# EAGLE board vr99-south-revA (EAGLE 9.6.2), part 1 of 3
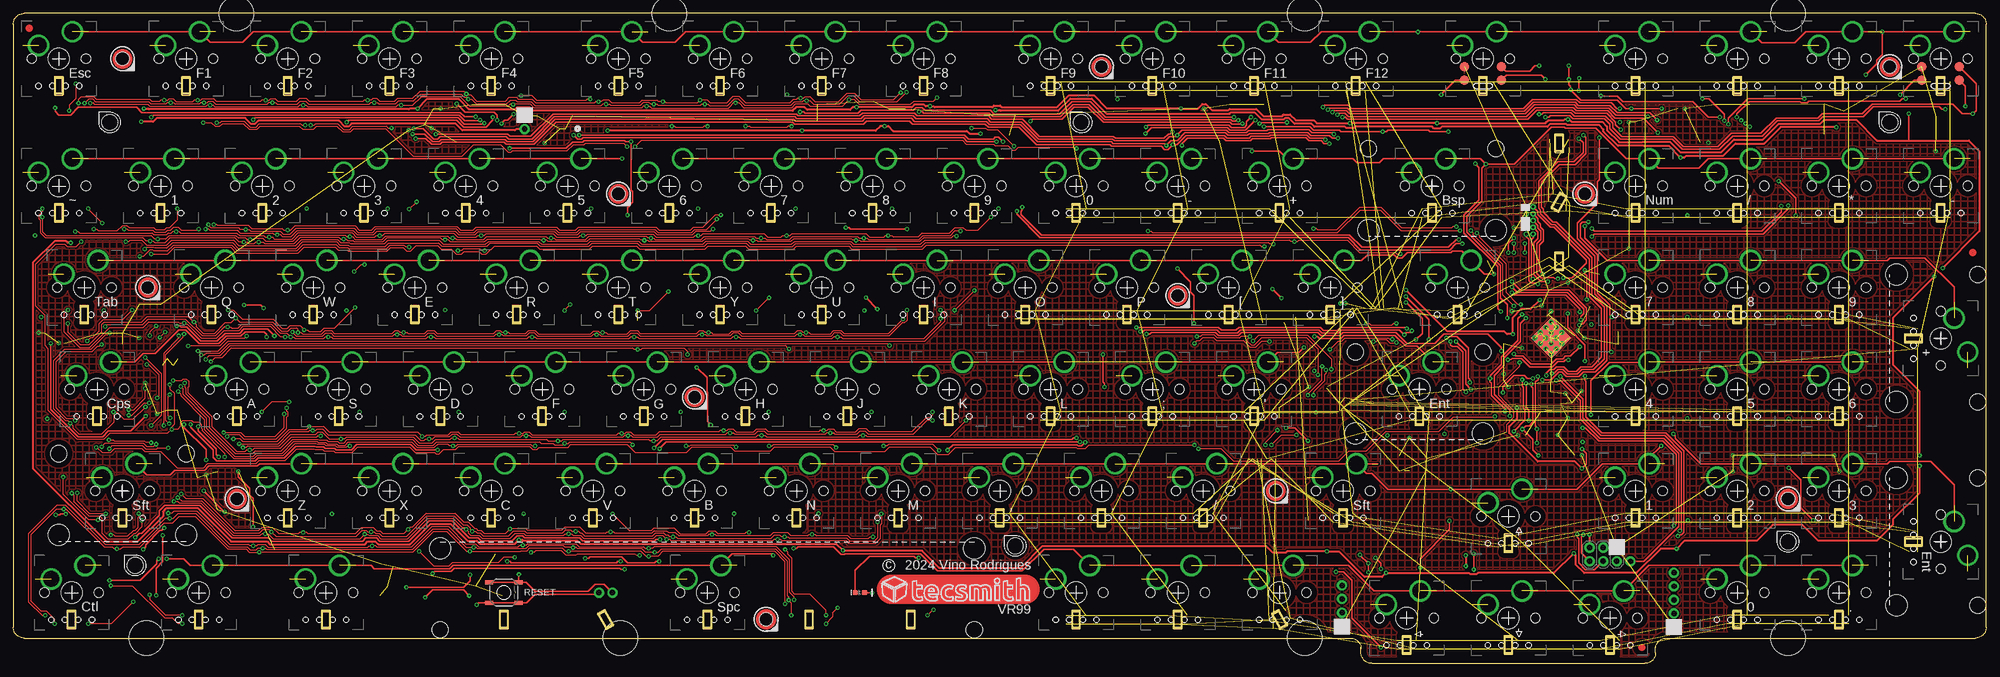
[diagram p4: board, top side]
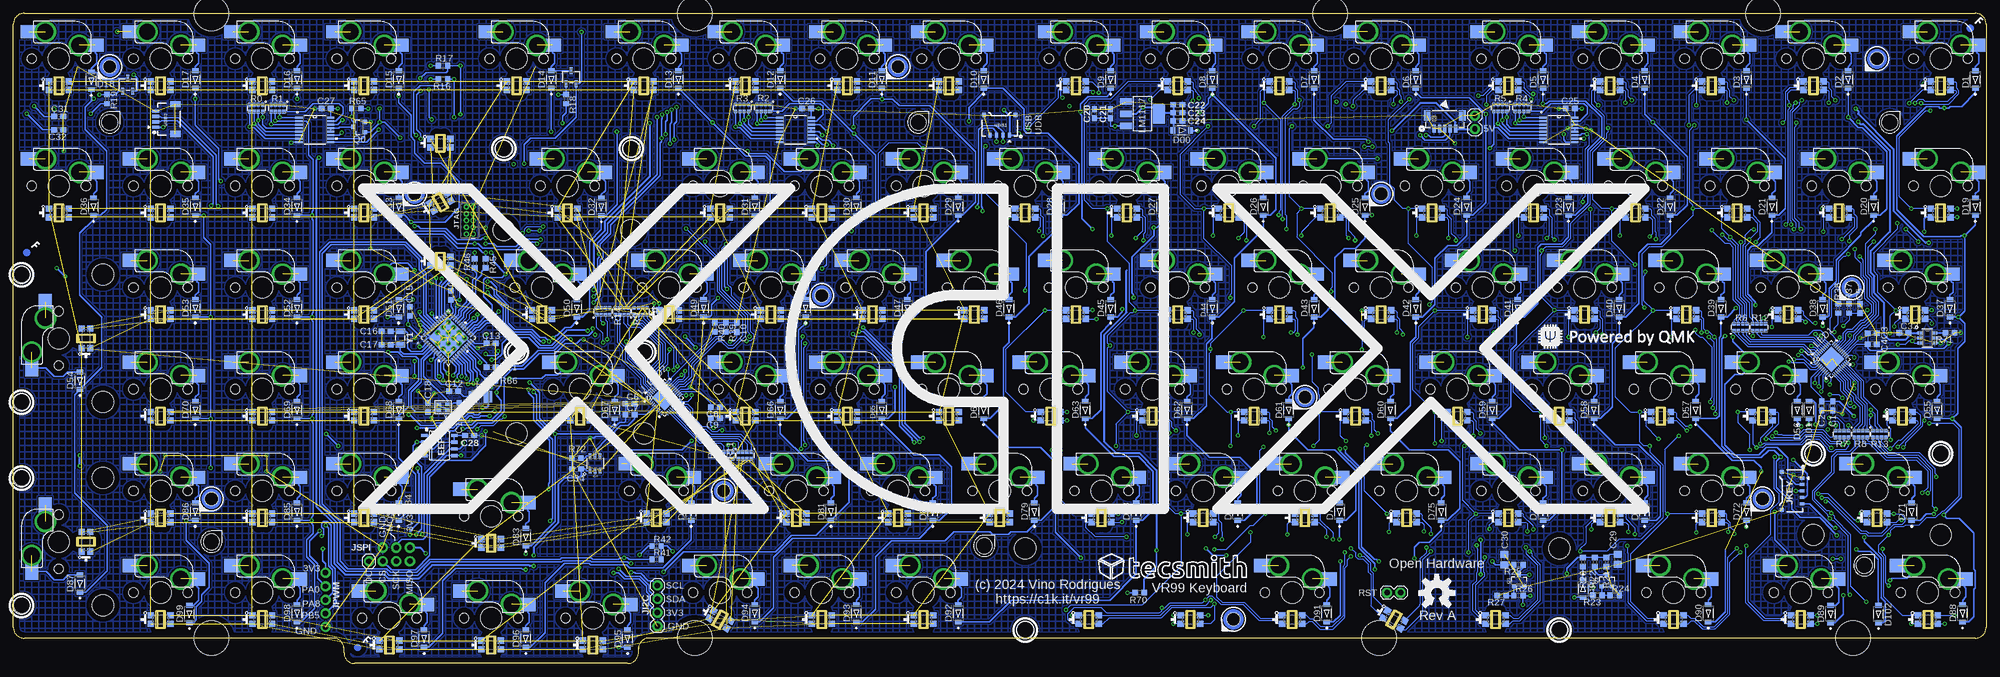
[diagram p5: board, bottom side, seen from below]

Size 369.48 x 121.83 mm. Coordinates in mm from the lower left corner, seen from the top.
Outline: 252.41,2.76 252.41,2 arc90 254.41,0 305.56,0 arc90 307.56,2 307.56,2.76
Outline: 252.41,2.76 252.41,3
Outline: 307.56,2.76 307.56,3
Outline: 307.56,2.76 arc-90 309.56,4.76 367.48,4.76 arc90 369.48,6.76 369.48,119.83 arc90 367.48,121.83 2,121.83 arc90 0,119.83 0,6.76 arc90 2,4.76 250.41,4.76 arc-90 252.41,2.76
Copper layers (1*16): Top 0.035mm / dielectric 1.5mm / Bottom 0.035mm
Design rules "default *": minimum track width 6mil, minimum drill 0.35mm, track to track 9.5mil, track to pad 9.5mil, pad to pad 9.5mil, via to via 9.5mil, smd to smd 9.5mil, copper to edge 40mil, drill to drill 4mil, minimum pad ring 10mil, minimum via ring 8mil, stop-mask expansion 4mil, vias tented up to drill 0mil, thermal gap 9.5mil
Holes 6.5 mm at 332.38,121.8 241.89,121.8 122.83,121.8 41.83,121.8 332.38,4.79 241.89,4.79 113.72,4.79 24.97,4.79

## Footprints (pad centres in the part's own frame; a part is rotated, then mirrored left to right if it is on the bottom)
1X02 = drill 1.016 pad 1.88: 1 0,0; 2 2.54,0
C0603 = smd 1.1 x 1: 1 -0.85,0; 2 0.85,0
0603 = smd 1.1 x 1: 1 -0.85,0; 2 0.85,0
C0805 = smd 1.3 x 1.5: 1 -0.95,0; 2 0.95,0
SOD-123 = smd 0.914 x 1.219: A 1.638,0; C -1.638,0
LED-0603 = smd 1 x 1: A -0.877,0; C 0.877,0
8-SOIC = smd 0.6 x 1.2: 1 -1.905,-2.8; 2 -0.635,-2.8; 3 0.635,-2.8; 4 1.905,-2.8; 5 1.905,2.8; 6 0.635,2.8; 7 -0.635,2.8; 8 -1.905,2.8
MGEEK-M2-HOLE = hole 3: 0,0
BRUTAL-1800-HOLE = hole 2.5: 0,0
MX-STABS-200U = hole 3.988: -11.938,8.255; 11.938,8.255 | hole 3.048: -11.938,-6.985; 11.938,-6.985
MX-STABS-625U = hole 3.988: -50,8.255; 50,8.255 | hole 3.048: -50,-6.985; 50,-6.985
1X04 = drill 1.016 pad 1.88: 1 0,0; 2 2.54,0; 3 5.08,0; 4 7.62,0
MOLEX_781710005 = smd 0.6 x 0.85: 1 -2.4,2; 2 -1.2,2; 3 0,2; 4 1.2,2; 5 2.4,2 | smd 0.7 x 0.8: NC1 -3.55,-1.775; NC2 3.55,-1.775
1X05_NO_SILK = drill 1.016 pad 1.88: 1 0,0; 2 2.54,0; 3 5.08,0; 4 7.62,0; 5 10.16,0
2X3-NS = drill 1.016 pad 1.88: 1 -2.54,-1.27; 2 -2.54,1.27; 3 0,-1.27; 4 0,1.27; 5 2.54,-1.27; 6 2.54,1.27
1X01 = drill 1.016 pad 1.88: 1 0,0
2X5-PTH-1.27MM-NO_SILK = drill 0.508 pad 1: 1 -2.54,-0.635; 2 -2.54,0.635; 3 -1.27,-0.635; 4 -1.27,0.635; 5 0,-0.635; 6 0,0.635; 7 1.27,-0.635; 8 1.27,0.635; 9 2.54,-0.635; 10 2.54,0.635
L3225M = smd 1.6 x 2.2: 1 -1.4,0; 2 1.4,0
SOT223 = smd 1.219 x 2.235: 1 -2.311,-3.099; 2 0,-3.099; 3 2.311,-3.099 | smd 3.6 x 2.2: 4 0,3.099
CONN5_SM05B-SRSS_JST = smd 0.66 x 1.549: 1 -2,-1.772; 2 -1,-1.772; 3 0,-1.772; 4 1,-1.772; 5 2,-1.772 | smd 1.295 x 1.905: 6 -3.3,0.698; 7 3.3,0.698
SOT23-3 = smd 0.8 x 0.9: 1 -0.95,-1; 2 0.95,-1; 3 0,1.1
R0603X4 = smd 0.7 x 0.6: 1 -0.65,1.2; 2 -0.65,0.4; 3 -0.65,-0.4; 4 -0.65,-1.2; 5 0.65,-1.2; 6 0.65,-0.4; 7 0.65,0.4; 8 0.65,1.2
R0603 = smd 1 x 1.1: 1 -0.85,0; 2 0.85,0
TACTILE_SWITCH_SMD_5.2MM = smd 1.524 x 0.762: 1 -2.794,1.905; 2 2.794,1.905; 3 -2.794,-1.905; 4 2.794,-1.905
MX-5-PIN-HOTSWAP-PAD = smd 3.15 x 2.5 bottom: 1@1 -6.785,2.54; 2@1 5.542,5.08 | drill 3 pad 3.75: 1@2 -3.81,2.54; 2@2 2.54,5.08 | hole 3.988: 0,0 | hole 1.75: -5.08,0; 5.08,0
MX-5-PIN-SKYLOONG-KNOB = smd 3.15 x 2.5 bottom: 1@1 -6.785,2.54; 2@1 5.542,5.08 | drill 3 pad 3.75: 1@2 -3.81,2.54; 2@2 2.54,5.08 | smd 1.75 x 1.75: A 3.5,-4; B 3.5,-1.5; C -3.5,-1.5; S -3.5,-4 | hole 3.988: 0,0 | hole 1.75: -5.08,0; 5.08,0
SOT-23-3L_AOS = smd 0.559 x 1.321: 1 -0.953,-1.194; 2 0.953,-1.194; 3 0,1.194
UFQFPN-48_7X7X0P55MM-THERM = smd 0.813 x 0.305: 1 -3.454,2.75; 2 -3.454,2.25; 3 -3.454,1.75; 4 -3.454,1.25; 5 -3.454,0.75; 6 -3.454,0.25; 7 -3.454,-0.25; 8 -3.454,-0.75; 9 -3.454,-1.25; 10 -3.454,-1.75; 11 -3.454,-2.25; 12 -3.454,-2.75; 25 3.454,-2.75; 26 3.454,-2.25; 27 3.454,-1.75; 28 3.454,-1.25; 29 3.454,-0.75; 30 3.454,-0.25; 31 3.454,0.25; 32 3.454,0.75; 33 3.454,1.25; 34 3.454,1.75; 35 3.454,2.25; 36 3.454,2.75 | smd 0.305 x 0.813: 13 -2.75,-3.454; 14 -2.25,-3.454; 15 -1.75,-3.454; 16 -1.25,-3.454; 17 -0.75,-3.454; 18 -0.25,-3.454; 19 0.25,-3.454; 20 0.75,-3.454; 21 1.25,-3.454; 22 1.75,-3.454; 23 2.25,-3.454; 24 2.75,-3.454; 37 2.75,3.454; 38 2.25,3.454; 39 1.75,3.454; 40 1.25,3.454; 41 0.75,3.454; 42 0.25,3.454; 43 -0.25,3.454; 44 -0.75,3.454; 45 -1.25,3.454; 46 -1.75,3.454; 47 -2.25,3.454; 48 -2.75,3.454 | smd 5 x 5.4: 49 0.2,0 | smd 0.4 x 5: 49@1 -2.5,-0.2 | smd 0.56 x 0.29 rotated 45: 49@2 -2.4,2.4 | smd 5.4 x 5.4 bottom: 49@3 0,0 | drill 0.4: 49@4 -0.711,2.134; 49@5 0.711,2.134; 49@6 2.134,2.134; 49@7 -2.134,0.711; 49@8 -0.711,0.711; 49@9 0.711,0.711; 49@10 2.134,0.711; 49@11 -2.134,-0.711; 49@12 -0.711,-0.711; 49@13 0.711,-0.711; 49@14 2.134,-0.711; 49@15 -2.134,-2.134; 49@16 -0.711,-2.134; 49@17 0.711,-2.134; 49@18 2.134,-2.134
TSSOP16 = smd 1.408 x 0.356: 1 -2.952,2.275; 2 -2.952,1.625; 3 -2.952,0.975; 4 -2.952,0.325; 5 -2.952,-0.325; 6 -2.952,-0.975; 7 -2.952,-1.625; 8 -2.952,-2.275; 9 2.952,-2.275; 10 2.952,-1.625; 11 2.952,-0.975; 12 2.952,-0.325; 13 2.952,0.325; 14 2.952,0.975; 15 2.952,1.625; 16 2.952,2.275
SOT-23-THIN-6_DDC_TEX = smd 1.003 x 0.559: 1 -1.378,0.95; 2 -1.378,0; 3 -1.378,-0.95; 4 1.378,-0.95; 5 1.378,0; 6 1.378,0.95
UQFN40 = smd 0.813 x 0.203: 1 -2.4,1.8; 2 -2.4,1.4; 3 -2.4,1; 4 -2.4,0.6; 5 -2.4,0.2; 6 -2.4,-0.2; 7 -2.4,-0.6; 8 -2.4,-1; 9 -2.4,-1.4; 10 -2.4,-1.8; 21 2.4,-1.8; 22 2.4,-1.4; 23 2.4,-1; 24 2.4,-0.6; 25 2.4,-0.2; 26 2.4,0.2; 27 2.4,0.6; 28 2.4,1; 29 2.4,1.4; 30 2.4,1.8 | smd 0.203 x 0.813: 11 -1.8,-2.4; 12 -1.4,-2.4; 13 -1,-2.4; 14 -0.6,-2.4; 15 -0.2,-2.4; 16 0.2,-2.4; 17 0.6,-2.4; 18 1,-2.4; 19 1.4,-2.4; 20 1.8,-2.4; 31 1.8,2.4; 32 1.4,2.4; 33 1,2.4; 34 0.6,2.4; 35 0.2,2.4; 36 -0.2,2.4; 37 -0.6,2.4; 38 -1,2.4; 39 -1.4,2.4; 40 -1.8,2.4 | smd 3 x 3.4: EPAD 0.225,0 | smd 0.566 x 0.566 rotated 315: EPAD@1 -1.278,1.299 | smd 0.4 x 3: EPAD@2 -1.477,-0.2
MOLEX_781710004 = smd 0.6 x 0.85: 1 -1.8,2; 2 -0.6,2; 3 0.6,2; 4 1.8,2 | smd 0.7 x 0.8: NC1 -2.95,-1.775; NC2 2.95,-1.775
JST_SM04B-SRSS-TB_LF_SN = smd 0.6 x 1.35: 1 -1.5,0; 2 -0.5,0; 3 0.5,0; 4 1.5,0 | smd 1.2 x 2: NC1 2.8,-3.675; NC2 -2.8,-3.675
CRYSTAL-SMD-3.2X1.5MM = smd 1 x 1.8: P$1 -1.25,0; P$2 1.25,0
CRYSTAL_2.5X2 = smd 0.9 x 0.75: 1 -0.825,-0.625; 2 0.825,-0.625; 3 0.825,0.625; 4 -0.825,0.625
156120M173000-MILL = smd 1.2 x 1.2: 1 -1.85,0.8; 2 -1.85,-0.8; 3 1.85,-0.8; 4 1.85,0.8

## Placement (x,y rotation side)
5V  [1X02]  95.75,100.15 90 bottom
C1  1uF  [C0603]  28.73,48.25 90 bottom
C2  0.1uF  [C0603]  30.77,48.25 90 bottom
C3  1uF  [C0603]  21.3,61.9 180 bottom
C4  0.1uF  [C0603]  21.3,59.83 180 bottom
C5  0.1uF  [C0603]  23.65,66.53 270 bottom
C6  1uF  [C0603]  254,48.67 0 bottom
C7  0.1uF  [C0603]  254,46.62 0 bottom
C8  1uF  [C0603]  238,48 180 bottom
C9  0.1uF  [C0603]  238,45.98 180 bottom
C10  0.1uF  [C0603]  234,63 270 bottom
C11  22uF  [C0603]  280,55.5 0 bottom
C12  100nF  [C0603]  287,51 180 bottom
C13  100nF  [C0603]  280,60 0 bottom
C14  100nF  [C0603]  287.5,69 90 bottom
C15  100nF  [C0603]  295.23,66 90 bottom
C16  4.3pF  [C0603]  299.65,62.25 180 bottom
C17  4.3pF  [C0603]  299.65,59.75 180 bottom
C18  12pF  [C0603]  291.85,48 90 bottom
C19  12pF  [C0603]  286,48 270 bottom
C20  22uF  [0603]  167,103 90 bottom
C21  100nF  [0603]  164,103 90 bottom
C22  100nF  [0603]  151.4,104.7 0 bottom
C23  22uF  [0603]  151.4,103.2 0 bottom
C24  4.7uF  [0603]  151.4,101.7 0 bottom
C25  100nF  [0603]  77.9,104 180 bottom
C26  100nF  [0603]  220.9,104 180 bottom
C27  100nF  [0603]  310.9,104 180 bottom
C28  100nF  [0603]  284,42.75 0 bottom
C29  10uF  [C0805]  68.95,19.5 270 bottom
C30  100nF  [C0805]  90.2,19.48 270 bottom
C31  100nF  [C0603]  361,102.5 0 bottom
C32  100nF  [C0603]  361,100 0 bottom
C33  1uF  [C0603]  15.42,61.95 0 bottom
C34  1uF  [C0603]  264.02,36.45 0 bottom
D00  B5819W SL  [SOD-123]  150.65,99.9 180 bottom
D1  [SOD-123]  2.03,109.43 90 bottom
D2  [SOD-123]  25.84,109.43 90 bottom
D3  [SOD-123]  44.89,109.43 90 bottom
D4  [SOD-123]  63.94,109.43 90 bottom
D5  [SOD-123]  82.99,109.43 90 bottom
D6  [SOD-123]  106.81,109.43 90 bottom
D7  [SOD-123]  125.86,109.43 90 bottom
D8  [SOD-123]  144.91,109.43 90 bottom
D9  [SOD-123]  163.96,109.43 90 bottom
D10  [SOD-123]  187.77,109.43 90 bottom
D11  [SOD-123]  206.82,109.43 90 bottom
D12  [SOD-123]  225.87,109.43 90 bottom
D13  [SOD-123]  244.92,109.43 90 bottom
D14  [SOD-123]  268.73,109.43 90 bottom
D15  [SOD-123]  297.31,109.43 90 bottom
D16  [SOD-123]  316.36,109.43 90 bottom
D17  [SOD-123]  335.41,109.43 90 bottom
D18  [SOD-123]  354.88,109.2 90 bottom
D19  [SOD-123]  2.03,85.61 90 bottom
D20  [SOD-123]  21.08,85.61 90 bottom
D21  [SOD-123]  40.13,85.61 90 bottom
D22  [SOD-123]  59.18,85.61 90 bottom
D23  [SOD-123]  78.23,85.61 90 bottom
D24  [SOD-123]  97.28,85.61 90 bottom
D25  [SOD-123]  116.33,85.61 90 bottom
D26  [SOD-123]  135.38,85.61 90 bottom
D27  [SOD-123]  154.43,85.61 90 bottom
D28  [SOD-123]  173.48,85.61 90 bottom
D29  [SOD-123]  192.53,85.61 90 bottom
D30  [SOD-123]  211.58,85.61 90 bottom
D31  [SOD-123]  230.63,85.61 90 bottom
D32  [SOD-123]  259.36,85.54 90 bottom
D33  [SOD-123]  297.31,85.61 90 bottom
D34  [SOD-123]  316.36,85.61 90 bottom
D35  [SOD-123]  335.41,85.61 90 bottom
D36  [SOD-123]  354.46,85.61 90 bottom
D37  [SOD-123]  6.79,66.56 90 bottom
D38  [SOD-123]  30.61,66.56 90 bottom
D39  [SOD-123]  49.66,66.56 90 bottom
D40  [SOD-123]  68.71,66.56 90 bottom
D41  [SOD-123]  87.76,66.56 90 bottom
D42  [SOD-123]  106.81,66.56 90 bottom
D43  [SOD-123]  125.86,66.56 90 bottom
D44  [SOD-123]  144.91,66.56 90 bottom
D45  [SOD-123]  163.96,66.56 90 bottom
D46  [SOD-123]  183.01,66.56 90 bottom
D47  [SOD-123]  202.06,66.56 90 bottom
D48  [SOD-123]  221.11,66.56 90 bottom
D49  [SOD-123]  240.21,66.56 90 bottom
D50  [SOD-123]  263.97,66.56 90 bottom
D51  [SOD-123]  297.31,66.56 90 bottom
D52  [SOD-123]  316.36,66.56 90 bottom
D53  [SOD-123]  335.41,66.56 90 bottom
D54  [SOD-123]  357,53 90 bottom
D55  [SOD-123]  9.18,47.52 90 bottom
D56  [SOD-123]  35.37,47.52 90 bottom
D57  [SOD-123]  54.42,47.52 90 bottom
D58  [SOD-123]  73.47,47.52 90 bottom
D59  [SOD-123]  92.52,47.52 90 bottom
D60  [SOD-123]  111.57,47.52 90 bottom
D61  [SOD-123]  130.62,47.52 90 bottom
D62  [SOD-123]  149.67,47.52 90 bottom
D63  [SOD-123]  168.72,47.52 90 bottom
D64  [SOD-123]  187.77,47.52 90 bottom
D65  [SOD-123]  206.82,47.52 90 bottom
D66  [SOD-123]  225.87,47.52 90 bottom
D67  [SOD-123]  256.82,47.52 90 bottom
D68  [SOD-123]  297.31,47.52 90 bottom
D69  [SOD-123]  316.36,47.52 90 bottom
D70  [SOD-123]  335.41,47.52 90 bottom
D71  [SOD-123]  13.94,28.46 90 bottom
D72  [SOD-123]  44.89,28.46 90 bottom
D73  [SOD-123]  63.94,28.46 90 bottom
D74  [SOD-123]  82.99,28.46 90 bottom
D75  [SOD-123]  102.04,28.46 90 bottom
D76  [SOD-123]  121.09,28.46 90 bottom
D77  [SOD-123]  140.14,28.46 90 bottom
D78  [SOD-123]  159.19,28.46 90 bottom
D79  [SOD-123]  178.24,28.46 90 bottom
D80  [SOD-123]  197.29,28.46 90 bottom
D81  [SOD-123]  216.34,28.46 90 bottom
D82  [SOD-123]  242.54,28.46 90 bottom
D83  [SOD-123]  273.49,23.7 90 bottom
D84  [SOD-123]  297.31,28.46 90 bottom
D85  [SOD-123]  316.36,28.46 90 bottom
D86  [SOD-123]  335.41,28.46 90 bottom
D87  [SOD-123]  357,15 90 bottom
D88  [SOD-123]  4.41,9.41 90 bottom
D89  [SOD-123]  29.12,9.29 90 bottom
D90  [SOD-123]  52.04,9.41 90 bottom
D91  [SOD-123]  123.47,9.41 90 bottom
D92  [SOD-123]  192.53,9.41 90 bottom
D93  [SOD-123]  211.58,9.41 90 bottom
D94  [SOD-123]  230.63,9.41 90 bottom
D95  [SOD-123]  254.44,4.65 90 bottom
D96  [SOD-123]  273.49,4.65 90 bottom
D97  [SOD-123]  292.54,4.65 90 bottom
D98  [SOD-123]  316.36,9.41 90 bottom
D99  [SOD-123]  336.51,9.29 90 bottom
D100  1N4148  [SOD-123]  75.5,14 270 bottom
D101  DNP  [SOD-123]  33.17,47.52 90 bottom
D102  DNP  [SOD-123]  20.18,9.29 90 bottom
D107  BLUE  [LED-0603]  158.54,13.29 180 top
EEP  M25C  [8-SOIC]  289.69,40.85 270 bottom
G1  MGEEK-M2-HOLE  [MGEEK-M2-HOLE]  18.05,101.39 0 top
G2  MGEEK-M2-HOLE  [MGEEK-M2-HOLE]  200,101.39 0 top
G3  MGEEK-M2-HOLE  [MGEEK-M2-HOLE]  351.43,101.39 0 top
G4  MGEEK-M2-HOLE  [MGEEK-M2-HOLE]  332.38,22.81 0 top
G5  MGEEK-M2-HOLE  [MGEEK-M2-HOLE]  187.65,22.05 0 top
G6  MGEEK-M2-HOLE  [MGEEK-M2-HOLE]  22.81,18.39 0 top
H1  BRURAL-1800-HOLE  [BRUTAL-1800-HOLE]  351.43,111.8 0 top
H2  BRURAL-1800-HOLE  [BRUTAL-1800-HOLE]  203.79,111.8 0 top
H3  BRURAL-1800-HOLE  [BRUTAL-1800-HOLE]  20.43,113.3 0 top
H4  BRURAL-1800-HOLE  [BRUTAL-1800-HOLE]  294.3,87.99 0 top
H5  BRURAL-1800-HOLE  [BRUTAL-1800-HOLE]  113.3,87.99 0 top
H6  BRURAL-1800-HOLE  [BRUTAL-1800-HOLE]  218.07,68.94 0 top
H7  BRURAL-1800-HOLE  [BRUTAL-1800-HOLE]  25.19,70.44 0 top
H8  BRURAL-1800-HOLE  [BRUTAL-1800-HOLE]  127.59,49.89 0 top
H9  BRURAL-1800-HOLE  [BRUTAL-1800-HOLE]  332.38,30.84 0 top
H10  BRURAL-1800-HOLE  [BRUTAL-1800-HOLE]  236.43,32.34 0 top
H11  BRURAL-1800-HOLE  [BRUTAL-1800-HOLE]  140.97,8.29 0 top
H12  BRURAL-1800-HOLE  [BRUTAL-1800-HOLE]  41.89,30.84 0 top
H_BSP  MX-STABS-200U  [MX-STABS-200U]  265.7,89.49 180 top
H_ENT  MX-STABS-200U  [MX-STABS-200U]  263.32,51.39 180 top
H_LS  MX-STABS-200U  [MX-STABS-200U]  20.43,32.34 180 top
H_NEN  MX-STABS-200U  [MX-STABS-200U]  360.95,22.81 90 top
H_NP  MX-STABS-200U  [MX-STABS-200U]  360.95,60.91 90 top
H_SPC  MX-STABS-625U  [MX-STABS-625U]  129.97,13.29 0 top
JI2C  [1X04]  248.84,14.62 270 bottom
JKEY  MOLEX_0781710005  [MOLEX_781710005]  36.5,32.34 270 bottom
JPWM  [1X05_NO_SILK]  311,17 270 top
JSPI  DNP  [2X3-NS]  297.75,20.45 0 top
JSPI@2  [1X01]  302.85,19.15 270 bottom
JTAG  CORTEX_JTAG_DEBUG_PTH_NS  [2X5-PTH-1.27MM-NO_SILK]  284,83 90 bottom
L1  10uH ±10%  [L3225M]  282,50 0 bottom
LM1117  AMS1117-3.3  [SOT223]  158,103 270 bottom
LOGO1  OSHW-LOGOL  [OSHW-LOGO-L]  102.89,13.22 0 bottom
M_M2  SM05B-SRSS-TB(LF)(SN)  [CONN5_SM05B-SRSS_JST]  101.39,102 0 bottom
Q0  2N7002  [SOT23-3]  304.68,100.53 90 bottom
Q1  2N7002  [SOT23-3]  87.5,15.5 0 bottom
Q2  2N7002  [SOT23-3]  71.05,15.5 0 bottom
R0  10K  [R0603X4]  324,104.05 270 bottom
R1  10K  [R0603X4]  320,104.05 270 bottom
R2  10K  [R0603X4]  229,104.1 270 bottom
R3  10K  [R0603X4]  233,104.1 270 bottom
R4  10K  [R0603X4]  87,104.1 270 bottom
R5  10K  [R0603X4]  91,104.1 270 bottom
R6  20R  [R0603X4]  46,63 90 bottom
R7  20R  [R0603X4]  27,43 270 bottom
R8  20R  [R0603X4]  23.5,43 270 bottom
R9  20R  [R0603X4]  255.5,66 90 bottom
R10  20R  [R0603X4]  252,66 90 bottom
R11  20R  [R0603X4]  232.5,39 270 bottom
R12  51R  [R0603X4]  42.5,63 90 bottom
R13  51R  [R0603X4]  20,43 270 bottom
R14  51R  [R0603X4]  259,66 90 bottom
R15  51R  [R0603X4]  236,39 270 bottom
R16  5.1K  [R0603]  289,109.5 180 bottom
R17  5.1K  [R0603]  289,112 180 bottom
R18  10K  [R0603]  265.95,105.75 270 bottom
R19  10K  [R0603]  351.95,105.75 270 bottom
R20  330K  [R0603]  75.5,19 270 bottom
R21  1M  [R0603]  71.1,19 90 bottom
R22  10K  [R0603]  73.3,19 90 bottom
R23  10K  [R0603]  72.75,12.75 180 bottom
R24  100K  [R0603]  69.55,12.75 0 bottom
R25  100R  [R0603]  87.6,18.5 180 bottom
R26  1K  [R0603]  87.6,12.72 0 bottom
R27  10K  [R0603]  90.72,12.72 180 bottom
R37  100K  [R0603]  25.68,66.53 270 bottom
R38  10K  [R0603]  27.73,66.53 270 bottom
R39  100K  [R0603]  236.05,63 270 bottom
R40  10K  [R0603]  238.1,63 270 bottom
R41  4K7  [R0603]  249,19.5 0 bottom
R42  4K7  [R0603]  249,22 0 bottom
R45  10R  [R0603]  281,75 270 bottom
R46  10R  [R0603]  283.05,75 270 bottom
R65  5.1K  [R0603]  305.25,104 0 bottom
R66  10K  [R0603]  280,53 180 bottom
R70  1K  [R0603]  158.54,13.29 180 bottom
R71  1K  [R0603]  6.75,61.97 180 bottom
R72  1K  [R0603]  264.02,38.48 0 bottom
RST  [1X02]  112.21,13.29 0 bottom
S1  Reset  [TACTILE_SWITCH_SMD_5.2MM]  91.87,13.29 0 top
SW_0  MX-5-PIN-HOTSWAP-PAD  [MX-5-PIN-HOTSWAP-PAD]  199.03,89.49 0 top
SW_1  MX-5-PIN-HOTSWAP-PAD  [MX-5-PIN-HOTSWAP-PAD]  27.57,89.49 0 top
SW_2  MX-5-PIN-HOTSWAP-PAD  [MX-5-PIN-HOTSWAP-PAD]  46.62,89.49 0 top
SW_3  MX-5-PIN-HOTSWAP-PAD  [MX-5-PIN-HOTSWAP-PAD]  65.67,89.49 0 top
SW_4  MX-5-PIN-HOTSWAP-PAD  [MX-5-PIN-HOTSWAP-PAD]  84.72,89.49 0 top
SW_5  MX-5-PIN-HOTSWAP-PAD  [MX-5-PIN-HOTSWAP-PAD]  103.78,89.49 0 top
SW_6  MX-5-PIN-HOTSWAP-PAD  [MX-5-PIN-HOTSWAP-PAD]  122.83,89.49 0 top
SW_7  MX-5-PIN-HOTSWAP-PAD  [MX-5-PIN-HOTSWAP-PAD]  141.88,89.49 0 top
SW_8  MX-5-PIN-HOTSWAP-PAD  [MX-5-PIN-HOTSWAP-PAD]  160.93,89.49 0 top
SW_9  MX-5-PIN-HOTSWAP-PAD  [MX-5-PIN-HOTSWAP-PAD]  179.97,89.49 0 top
SW_A  MX-5-PIN-HOTSWAP-PAD  [MX-5-PIN-HOTSWAP-PAD]  41.86,51.39 0 top
SW_B  MX-5-PIN-HOTSWAP-PAD  [MX-5-PIN-HOTSWAP-PAD]  127.59,32.34 0 top
SW_BSP  MX-5-PIN-HOTSWAP-PAD  [MX-5-PIN-HOTSWAP-PAD]  265.7,89.49 0 top
SW_C  MX-5-PIN-HOTSWAP-PAD  [MX-5-PIN-HOTSWAP-PAD]  89.49,32.34 0 top
SW_CB  MX-5-PIN-HOTSWAP-PAD  [MX-5-PIN-HOTSWAP-PAD]  246.65,70.44 0 top
SW_CL  MX-5-PIN-HOTSWAP-PAD  [MX-5-PIN-HOTSWAP-PAD]  15.67,51.39 0 top
SW_CM  MX-5-PIN-HOTSWAP-PAD  [MX-5-PIN-HOTSWAP-PAD]  184.74,32.34 0 top
SW_CS  MX-5-PIN-HOTSWAP-PAD  [MX-5-PIN-HOTSWAP-PAD]  213.31,51.39 0 top
SW_D  MX-5-PIN-HOTSWAP-PAD  [MX-5-PIN-HOTSWAP-PAD]  79.96,51.39 0 top
SW_DN  MX-5-PIN-HOTSWAP-PAD  [MX-5-PIN-HOTSWAP-PAD]  279.99,8.53 0 top
SW_DP  MX-5-PIN-HOTSWAP-PAD  [MX-5-PIN-HOTSWAP-PAD]  270.46,70.44 0 top
SW_DSH  MX-5-PIN-HOTSWAP-PAD  [MX-5-PIN-HOTSWAP-PAD]  322.85,89.49 0 top
SW_DT  MX-5-PIN-HOTSWAP-PAD  [MX-5-PIN-HOTSWAP-PAD]  203.79,32.34 0 top
SW_E  MX-5-PIN-HOTSWAP-PAD  [MX-5-PIN-HOTSWAP-PAD]  75.2,70.44 0 top
SW_ENT  MX-5-PIN-HOTSWAP-PAD  [MX-5-PIN-HOTSWAP-PAD]  263.32,51.39 0 top
SW_EP  MX-5-PIN-HOTSWAP-PAD  [MX-5-PIN-HOTSWAP-PAD]  237.12,89.49 0 top
SW_ESC  MX-5-PIN-HOTSWAP-PAD  [MX-5-PIN-HOTSWAP-PAD]  8.53,113.3 0 top
SW_F  MX-5-PIN-HOTSWAP-PAD  [MX-5-PIN-HOTSWAP-PAD]  99.01,51.39 0 top
SW_F1  MX-5-PIN-HOTSWAP-PAD  [MX-5-PIN-HOTSWAP-PAD]  32.34,113.3 0 top
SW_F2  MX-5-PIN-HOTSWAP-PAD  [MX-5-PIN-HOTSWAP-PAD]  51.39,113.3 0 top
SW_F3  MX-5-PIN-HOTSWAP-PAD  [MX-5-PIN-HOTSWAP-PAD]  70.44,113.3 0 top
SW_F4  MX-5-PIN-HOTSWAP-PAD  [MX-5-PIN-HOTSWAP-PAD]  89.49,113.3 0 top
SW_F5  MX-5-PIN-HOTSWAP-PAD  [MX-5-PIN-HOTSWAP-PAD]  113.3,113.3 0 top
SW_F6  MX-5-PIN-HOTSWAP-PAD  [MX-5-PIN-HOTSWAP-PAD]  132.35,113.3 0 top
SW_F7  MX-5-PIN-HOTSWAP-PAD  [MX-5-PIN-HOTSWAP-PAD]  151.4,113.3 0 top
SW_F8  MX-5-PIN-HOTSWAP-PAD  [MX-5-PIN-HOTSWAP-PAD]  170.45,113.3 0 top
SW_F9  MX-5-PIN-HOTSWAP-PAD  [MX-5-PIN-HOTSWAP-PAD]  194.26,113.3 0 top
SW_F10  MX-5-PIN-HOTSWAP-PAD  [MX-5-PIN-HOTSWAP-PAD]  213.31,113.3 0 top
SW_F11  MX-5-PIN-HOTSWAP-PAD  [MX-5-PIN-HOTSWAP-PAD]  232.36,113.3 0 top
SW_F12  MX-5-PIN-HOTSWAP-PAD  [MX-5-PIN-HOTSWAP-PAD]  251.41,113.3 0 top
SW_F13  MX-5-PIN-SKYLOONG-KNOB  [MX-5-PIN-SKYLOONG-KNOB]  275.23,113.3 0 top
SW_F14  MX-5-PIN-HOTSWAP-PAD  [MX-5-PIN-HOTSWAP-PAD]  303.8,113.3 0 top
SW_F15  MX-5-PIN-HOTSWAP-PAD  [MX-5-PIN-HOTSWAP-PAD]  322.85,113.3 0 top
SW_F16  MX-5-PIN-HOTSWAP-PAD  [MX-5-PIN-HOTSWAP-PAD]  341.9,113.3 0 top
SW_F17  MX-5-PIN-SKYLOONG-KNOB  [MX-5-PIN-SKYLOONG-KNOB]  360.95,113.3 0 top
SW_FS  MX-5-PIN-HOTSWAP-PAD  [MX-5-PIN-HOTSWAP-PAD]  222.84,32.34 0 top
SW_G  MX-5-PIN-HOTSWAP-PAD  [MX-5-PIN-HOTSWAP-PAD]  118.06,51.39 0 top
SW_H  MX-5-PIN-HOTSWAP-PAD  [MX-5-PIN-HOTSWAP-PAD]  137.11,51.39 0 top
SW_I  MX-5-PIN-HOTSWAP-PAD  [MX-5-PIN-HOTSWAP-PAD]  170.45,70.44 0 top
SW_J  MX-5-PIN-HOTSWAP-PAD  [MX-5-PIN-HOTSWAP-PAD]  156.16,51.39 0 top
SW_K  MX-5-PIN-HOTSWAP-PAD  [MX-5-PIN-HOTSWAP-PAD]  175.21,51.39 0 top
SW_L  MX-5-PIN-HOTSWAP-PAD  [MX-5-PIN-HOTSWAP-PAD]  194.26,51.39 0 top
SW_LA  MX-5-PIN-HOTSWAP-PAD  [MX-5-PIN-HOTSWAP-PAD]  58.53,13.29 0 top
SW_LC  MX-5-PIN-HOTSWAP-PAD  [MX-5-PIN-HOTSWAP-PAD]  10.91,13.29 0 top
SW_LF  MX-5-PIN-HOTSWAP-PAD  [MX-5-PIN-HOTSWAP-PAD]  260.94,8.53 0 top
SW_LS  MX-5-PIN-HOTSWAP-PAD  [MX-5-PIN-HOTSWAP-PAD]  20.43,32.34 0 top
SW_LW  MX-5-PIN-HOTSWAP-PAD  [MX-5-PIN-HOTSWAP-PAD]  34.72,13.29 0 top
SW_M  MX-5-PIN-HOTSWAP-PAD  [MX-5-PIN-HOTSWAP-PAD]  165.69,32.34 0 top
SW_MIN  MX-5-PIN-HOTSWAP-PAD  [MX-5-PIN-HOTSWAP-PAD]  360.95,89.49 0 top
SW_MU  MX-5-PIN-HOTSWAP-PAD  [MX-5-PIN-HOTSWAP-PAD]  218.07,89.49 0 top
SW_MUL  MX-5-PIN-HOTSWAP-PAD  [MX-5-PIN-HOTSWAP-PAD]  341.9,89.49 0 top
SW_N  MX-5-PIN-HOTSWAP-PAD  [MX-5-PIN-HOTSWAP-PAD]  146.64,32.34 0 top
SW_N0  MX-5-PIN-HOTSWAP-PAD  [MX-5-PIN-HOTSWAP-PAD]  322.85,13.29 0 top
SW_N1  MX-5-PIN-HOTSWAP-PAD  [MX-5-PIN-HOTSWAP-PAD]  303.8,32.34 0 top
SW_N2  MX-5-PIN-HOTSWAP-PAD  [MX-5-PIN-HOTSWAP-PAD]  322.85,32.34 0 top
SW_N3  MX-5-PIN-HOTSWAP-PAD  [MX-5-PIN-HOTSWAP-PAD]  341.9,32.34 0 top
SW_N4  MX-5-PIN-HOTSWAP-PAD  [MX-5-PIN-HOTSWAP-PAD]  303.8,51.39 0 top
SW_N5  MX-5-PIN-HOTSWAP-PAD  [MX-5-PIN-HOTSWAP-PAD]  322.85,51.39 0 top
SW_N6  MX-5-PIN-HOTSWAP-PAD  [MX-5-PIN-HOTSWAP-PAD]  341.9,51.39 0 top
SW_N7  MX-5-PIN-HOTSWAP-PAD  [MX-5-PIN-HOTSWAP-PAD]  303.8,70.44 0 top
SW_N8  MX-5-PIN-HOTSWAP-PAD  [MX-5-PIN-HOTSWAP-PAD]  322.85,70.44 0 top
SW_N9  MX-5-PIN-HOTSWAP-PAD  [MX-5-PIN-HOTSWAP-PAD]  341.9,70.44 0 top
SW_ND  MX-5-PIN-HOTSWAP-PAD  [MX-5-PIN-HOTSWAP-PAD]  341.9,13.29 0 top
SW_NEN  MX-5-PIN-HOTSWAP-PAD  [MX-5-PIN-HOTSWAP-PAD]  360.95,22.81 270 top
SW_NP  MX-5-PIN-HOTSWAP-PAD  [MX-5-PIN-HOTSWAP-PAD]  360.95,60.91 270 top
SW_NUM  MX-5-PIN-HOTSWAP-PAD  [MX-5-PIN-HOTSWAP-PAD]  303.8,89.49 0 top
SW_O  MX-5-PIN-HOTSWAP-PAD  [MX-5-PIN-HOTSWAP-PAD]  189.5,70.44 0 top
SW_OB  MX-5-PIN-HOTSWAP-PAD  [MX-5-PIN-HOTSWAP-PAD]  227.6,70.44 0 top
SW_P  MX-5-PIN-HOTSWAP-PAD  [MX-5-PIN-HOTSWAP-PAD]  208.55,70.44 0 top
SW_Q  MX-5-PIN-HOTSWAP-PAD  [MX-5-PIN-HOTSWAP-PAD]  37.1,70.44 0 top
SW_QU  MX-5-PIN-HOTSWAP-PAD  [MX-5-PIN-HOTSWAP-PAD]  232.36,51.39 0 top
SW_R  MX-5-PIN-HOTSWAP-PAD  [MX-5-PIN-HOTSWAP-PAD]  94.25,70.44 0 top
SW_RA  MX-5-PIN-HOTSWAP-PAD  [MX-5-PIN-HOTSWAP-PAD]  199.03,13.29 0 top
SW_RC  MX-5-PIN-HOTSWAP-PAD  [MX-5-PIN-HOTSWAP-PAD]  237.12,13.29 0 top
SW_RS  MX-5-PIN-HOTSWAP-PAD  [MX-5-PIN-HOTSWAP-PAD]  249.03,32.34 0 top
SW_RT  MX-5-PIN-HOTSWAP-PAD  [MX-5-PIN-HOTSWAP-PAD]  299.04,8.53 0 top
SW_RW  MX-5-PIN-HOTSWAP-PAD  [MX-5-PIN-HOTSWAP-PAD]  218.07,13.29 0 top
SW_S  MX-5-PIN-HOTSWAP-PAD  [MX-5-PIN-HOTSWAP-PAD]  60.91,51.39 0 top
SW_SPC  MX-5-PIN-HOTSWAP-PAD  [MX-5-PIN-HOTSWAP-PAD]  129.97,13.29 0 top
SW_T  MX-5-PIN-HOTSWAP-PAD  [MX-5-PIN-HOTSWAP-PAD]  113.3,70.44 0 top
SW_TAB  MX-5-PIN-HOTSWAP-PAD  [MX-5-PIN-HOTSWAP-PAD]  13.29,70.44 0 top
SW_TDL  MX-5-PIN-HOTSWAP-PAD  [MX-5-PIN-HOTSWAP-PAD]  8.53,89.49 0 top
SW_U  MX-5-PIN-HOTSWAP-PAD  [MX-5-PIN-HOTSWAP-PAD]  151.4,70.44 0 top
SW_UP  MX-5-PIN-HOTSWAP-PAD  [MX-5-PIN-HOTSWAP-PAD]  279.99,27.57 0 top
SW_V  MX-5-PIN-HOTSWAP-PAD  [MX-5-PIN-HOTSWAP-PAD]  108.54,32.34 0 top
SW_W  MX-5-PIN-HOTSWAP-PAD  [MX-5-PIN-HOTSWAP-PAD]  56.15,70.44 0 top
SW_X  MX-5-PIN-HOTSWAP-PAD  [MX-5-PIN-HOTSWAP-PAD]  70.44,32.34 0 top
SW_Y  MX-5-PIN-HOTSWAP-PAD  [MX-5-PIN-HOTSWAP-PAD]  132.35,70.44 0 top
SW_Z  MX-5-PIN-HOTSWAP-PAD  [MX-5-PIN-HOTSWAP-PAD]  51.39,32.34 0 top
T2  AO3401A  [SOT-23-3L_AOS]  265,109.85 0 bottom
T3  AO3401A  [SOT-23-3L_AOS]  348.05,108.47 0 bottom
U1  STM32F411CEU7THERM  [UFQFPN-48_7X7X0P55MM-THERM]  288,61 45 bottom
U2  74HC589A_DT  [TSSOP16]  80,100 0 bottom
U3  74HC589A_DT  [TSSOP16]  223,100 0 bottom
U4  74HC589A_DT  [TSSOP16]  313,100 0 bottom
U5  TPS22995H-Q1  [SOT-23-THIN-6_DDC_TEX]  11,61 0 bottom
U6  TPS22995H-Q1  [SOT-23-THIN-6_DDC_TEX]  260.5,37.5 90 bottom
U$1  FIDUCIAL  [FIDUCIAL]  3,119 0 top
U$2  FIDUCIAL  [FIDUCIAL]  305,3 0 top
U$3  FIDUCIAL  [FIDUCIAL]  367,77 0 top
U$4  QMK_LOGO  [QMK_LOGO]  83.98,58.91 0 bottom
U$5  TECSMITH-LOGOLONG  [TECSMITH-NAME]  163.85,18.3 0 bottom
U$6  TECSMITH-LOGOLONG  [TECSMITH-NAME]  165,14 0 top
U_LED1  IS31FL3743B  [UQFN40]  29,57 45 bottom
U_LED2  IS31FL3743B  [UQFN40]  247.5,49.79 45 bottom
UDB1  [MOLEX_781710004]  184.74,101 180 bottom
UDB2  [JST_SM04B-SRSS-TB_LF_SN]  342.8,102 90 bottom
Y1  32.768kHz ±20ppm 6pF  [CRYSTAL-SMD-3.2X1.5MM]  297,61 90 bottom
Y2  25MHz 9pF  [CRYSTAL_2.5X2]  289,48 180 bottom
Z1  156120M173000MILL  [156120M173000-MILL]  8.53,108.25 0 bottom
Z2  156120M173000MILL  [156120M173000-MILL]  32.34,108.25 0 bottom
Z3  156120M173000MILL  [156120M173000-MILL]  51.39,108.25 0 bottom
Z4  156120M173000MILL  [156120M173000-MILL]  70.44,108.25 0 bottom
Z5  156120M173000MILL  [156120M173000-MILL]  89.49,108.25 0 bottom
Z6  156120M173000MILL  [156120M173000-MILL]  113.3,108.25 0 bottom
Z7  156120M173000MILL  [156120M173000-MILL]  132.35,108.25 0 bottom
Z8  156120M173000MILL  [156120M173000-MILL]  151.4,108.25 0 bottom
Z9  156120M173000MILL  [156120M173000-MILL]  170.45,108.25 0 bottom
Z10  156120M173000MILL  [156120M173000-MILL]  194.26,108.25 0 bottom
Z11  156120M173000MILL  [156120M173000-MILL]  213.31,108.25 0 bottom
Z12  156120M173000MILL  [156120M173000-MILL]  232.36,108.25 0 bottom
Z13  156120M173000MILL  [156120M173000-MILL]  251.41,108.25 0 bottom
Z14  156120M173000MILL  [156120M173000-MILL]  275.23,108.25 0 bottom
Z15  156120M173000MILL  [156120M173000-MILL]  303.8,108.25 0 bottom
Z16  156120M173000MILL  [156120M173000-MILL]  322.85,108.25 0 bottom
Z17  156120M173000MILL  [156120M173000-MILL]  341.9,108.25 0 bottom
Z18  156120M173000MILL  [156120M173000-MILL]  360.95,108.25 0 bottom
Z19  DNP  [156120M173000-MILL]  8.53,84.44 0 bottom
Z20  156120M173000MILL  [156120M173000-MILL]  27.57,84.44 0 bottom
Z21  156120M173000MILL  [156120M173000-MILL]  46.62,84.44 0 bottom
Z22  156120M173000MILL  [156120M173000-MILL]  65.67,84.44 0 bottom
Z23  156120M173000MILL  [156120M173000-MILL]  84.72,84.44 0 bottom
Z24  156120M173000MILL  [156120M173000-MILL]  103.78,84.44 0 bottom
Z25  156120M173000MILL  [156120M173000-MILL]  122.83,84.44 0 bottom
Z26  156120M173000MILL  [156120M173000-MILL]  141.88,84.44 0 bottom
Z27  156120M173000MILL  [156120M173000-MILL]  160.93,84.44 0 bottom
Z28  156120M173000MILL  [156120M173000-MILL]  179.97,84.44 0 bottom
Z29  156120M173000MILL  [156120M173000-MILL]  199.03,84.44 0 bottom
Z30  156120M173000MILL  [156120M173000-MILL]  218.07,84.44 0 bottom
Z31  156120M173000MILL  [156120M173000-MILL]  237.12,84.44 0 bottom
Z32  156120M173000MILL  [156120M173000-MILL]  265.7,84.44 0 bottom
Z33  156120M173000MILL  [156120M173000-MILL]  303.8,84.44 0 bottom
Z34  156120M173000MILL  [156120M173000-MILL]  322.85,84.44 0 bottom
Z35  156120M173000MILL  [156120M173000-MILL]  341.9,84.44 0 bottom
Z36  156120M173000MILL  [156120M173000-MILL]  360.95,84.44 0 bottom
Z37  156120M173000MILL  [156120M173000-MILL]  13.29,65.39 0 bottom
Z38  156120M173000MILL  [156120M173000-MILL]  37.1,65.39 0 bottom
Z39  156120M173000MILL  [156120M173000-MILL]  56.15,65.39 0 bottom
Z40  156120M173000MILL  [156120M173000-MILL]  75.2,65.39 0 bottom
Z41  156120M173000MILL  [156120M173000-MILL]  94.25,65.39 0 bottom
Z42  156120M173000MILL  [156120M173000-MILL]  113.3,65.39 0 bottom
Z43  156120M173000MILL  [156120M173000-MILL]  132.35,65.39 0 bottom
Z44  156120M173000MILL  [156120M173000-MILL]  151.4,65.39 0 bottom
Z45  156120M173000MILL  [156120M173000-MILL]  170.45,65.39 0 bottom
Z46  156120M173000MILL  [156120M173000-MILL]  189.5,65.39 0 bottom
Z47  156120M173000MILL  [156120M173000-MILL]  208.55,65.39 0 bottom
Z48  156120M173000MILL  [156120M173000-MILL]  227.6,65.39 0 bottom
Z49  156120M173000MILL  [156120M173000-MILL]  246.65,65.39 0 bottom
Z50  156120M173000MILL  [156120M173000-MILL]  270.46,65.39 0 bottom
Z51  156120M173000MILL  [156120M173000-MILL]  303.8,65.39 0 bottom
Z52  156120M173000MILL  [156120M173000-MILL]  322.85,65.39 0 bottom
Z53  156120M173000MILL  [156120M173000-MILL]  341.9,65.39 0 bottom
Z54  156120M173000MILL  [156120M173000-MILL]  355.87,60.91 90 bottom
Z55  156120M173000MILL  [156120M173000-MILL]  15.67,46.34 0 bottom
Z56  156120M173000MILL  [156120M173000-MILL]  41.86,46.34 0 bottom
Z57  156120M173000MILL  [156120M173000-MILL]  60.91,46.34 0 bottom
Z58  156120M173000MILL  [156120M173000-MILL]  79.96,46.34 0 bottom
Z59  156120M173000MILL  [156120M173000-MILL]  99.01,46.34 0 bottom
Z60  156120M173000MILL  [156120M173000-MILL]  118.06,46.34 0 bottom
Z61  156120M173000MILL  [156120M173000-MILL]  137.11,46.34 0 bottom
Z62  156120M173000MILL  [156120M173000-MILL]  156.16,46.34 0 bottom
Z63  156120M173000MILL  [156120M173000-MILL]  175.21,46.34 0 bottom
Z64  156120M173000MILL  [156120M173000-MILL]  194.26,46.34 0 bottom
Z65  156120M173000MILL  [156120M173000-MILL]  213.31,46.34 0 bottom
Z66  156120M173000MILL  [156120M173000-MILL]  232.36,46.34 0 bottom
Z67  156120M173000MILL  [156120M173000-MILL]  263.32,46.34 0 bottom
Z68  156120M173000MILL  [156120M173000-MILL]  303.8,46.34 0 bottom
Z69  156120M173000MILL  [156120M173000-MILL]  322.85,46.34 0 bottom
Z70  156120M173000MILL  [156120M173000-MILL]  341.9,46.34 0 bottom
Z71  156120M173000MILL  [156120M173000-MILL]  20.43,27.29 0 bottom
Z72  156120M173000MILL  [156120M173000-MILL]  51.39,27.29 0 bottom
Z73  156120M173000MILL  [156120M173000-MILL]  70.44,27.29 0 bottom
Z74  156120M173000MILL  [156120M173000-MILL]  89.49,27.29 0 bottom
Z75  156120M173000MILL  [156120M173000-MILL]  108.54,27.29 0 bottom
Z76  156120M173000MILL  [156120M173000-MILL]  127.59,27.29 0 bottom
Z77  156120M173000MILL  [156120M173000-MILL]  146.64,27.29 0 bottom
Z78  156120M173000MILL  [156120M173000-MILL]  165.69,27.29 0 bottom
Z79  156120M173000MILL  [156120M173000-MILL]  184.74,27.29 0 bottom
Z80  156120M173000MILL  [156120M173000-MILL]  203.79,27.29 0 bottom
Z81  156120M173000MILL  [156120M173000-MILL]  222.84,27.29 0 bottom
Z82  156120M173000MILL  [156120M173000-MILL]  249.03,27.29 0 bottom
Z83  156120M173000MILL  [156120M173000-MILL]  279.99,22.52 0 bottom
Z84  156120M173000MILL  [156120M173000-MILL]  303.8,27.29 0 bottom
Z85  156120M173000MILL  [156120M173000-MILL]  322.85,27.29 0 bottom
Z86  156120M173000MILL  [156120M173000-MILL]  341.9,27.29 0 bottom
Z87  156120M173000MILL  [156120M173000-MILL]  355.87,22.81 90 bottom
Z88  156120M173000MILL  [156120M173000-MILL]  10.91,8.24 0 bottom
Z89  156120M173000MILL  [156120M173000-MILL]  34.72,8.24 0 bottom
Z90  156120M173000MILL  [156120M173000-MILL]  58.53,8.24 0 bottom
Z91  156120M173000MILL  [156120M173000-MILL]  129.97,8.24 0 bottom
Z92  156120M173000MILL  [156120M173000-MILL]  199.03,8.24 0 bottom
Z93  156120M173000MILL  [156120M173000-MILL]  218.07,8.24 0 bottom
Z94  156120M173000MILL  [156120M173000-MILL]  237.12,8.24 330 bottom
Z95  156120M173000MILL  [156120M173000-MILL]  260.94,3.47 0 bottom
Z96  156120M173000MILL  [156120M173000-MILL]  279.99,3.47 0 bottom
Z97  156120M173000MILL  [156120M173000-MILL]  299.04,3.47 0 bottom
Z98  156120M173000MILL  [156120M173000-MILL]  322.85,8.24 0 bottom
Z99  156120M173000MILL  [156120M173000-MILL]  341.9,8.24 0 bottom
Z101  156120M173000MILL  [156120M173000-MILL]  289.51,97.49 0 bottom
Z102  156120M173000MILL  [156120M173000-MILL]  289.51,86.44 30 bottom
Z103  156120M173000MILL  [156120M173000-MILL]  289.51,75.39 0 bottom
Z104  156120M173000MILL  [156120M173000-MILL]  91.87,8.24 0 bottom
Z105  156120M173000MILL  [156120M173000-MILL]  110.92,8.24 330 bottom
Z106  156120M173000MILL  [156120M173000-MILL]  149.02,8.24 0 bottom
Z107  156120M173000MILL  [156120M173000-MILL]  168.07,8.24 0 bottom

## Tracks (layer width: path | path; a pad name or v marks a point on that pad's centre or on a via)
!RESET  (via drill 0.35)
  Top 0.254: v291.25,56.85 290.65,56.85 290.38,56.58 289.23,56.58 288.25,55.6 284.02,55.6 282.48,57.15 280.71,57.15 280.48,56.92 v279.9,56.92 | v120,40.42 121.58,42 198.22,42 198.5,42.27 v199.1,42.27 | v260.95,62.75 260.71,63 248.57,63 247.99,62.42 245.33,62.42 244.75,63 229.55,63 229,62.45 226.22,62.45 225.68,63 v210.3,63 | v92.47,19.12 93,19.12 93.25,18.88 112.95,18.88 113.2,19.13 v113.75,19.13
  Bottom 0.254: U1.7 290.7,57.95 290.7,57.4 v291.25,56.85 | v120,40.42 120,39.5 116.97,36.48 116.97,21.9 114.6,19.53 114.15,19.53 v113.75,19.13 | v279.9,56.92 279.03,56.92 277.92,58.02 277.92,59.98 276.79,61.11 272.98,61.11 270.99,59.12 268.41,59.12 266.05,61.49 261.71,61.49 260.95,62.25 v260.95,62.75 | v210.3,63 202.5,55.2 202.5,45 199.78,42.27 v199.1,42.27 | R25.2 90.17,18.5 C30.2 91.88,18.52 v92.47,19.12
AUX_CS  (via drill 0.35)
  Top 0.254: v282.57,53.17 282.57,52 282.83,51.75 282.83,47.77 283.11,47.49 283.11,45.63 v281,43.52
  Bottom 0.254: U1.19 283.4,56.75 283.4,55.33 282.57,54.5 v282.57,53.17 | v281,43.52 281,40.85 283.75,38.1 288.4,38.1 291.5,35 291.5,20.23 294.18,17.55 298.65,17.55 JSPI.5
AUX_DC  (via drill 0.35)
  Top 0.254: v288.95,53.05 289.75,53.05 293.48,49.32 293.48,45.82 297.1,42.2 309.1,42.2 311.9,39.4 311.9,25.71 305.34,19.15 JSPI@2.1
  Bottom 0.254: U1.11 289.45,56.37 289.45,54.65 288.95,54.15 v288.95,53.05
BLU1  (via drill 0.35)
  Top 0.203: v37.52,82.28 38.09,82.28 38.3,82.07 44.06,82.07 44.61,81.52 50.3,81.52 50.6,81.22 v51.35,81.22 51.94,81.22 52.77,82.05 63.99,82.05 64.8,81.24 67.13,81.24 67.78,81.89 83.14,81.89 83.8,81.24 86.15,81.24 86.71,81.8 101.74,81.8 102.3,81.24 105.27,81.24 105.83,81.8 120.37,81.8 120.93,81.24 126.85,81.24 127.41,81.8 129.19,81.8 131.47,84.06 v132.5,84.06 | v14.4,104.98 15.02,104.98 15.28,104.72 25.25,104.72 25.6,104.37 36,104.37 36.27,104.65 v36.88,104.65 37.45,104.65 37.73,104.37 53.38,104.37 53.65,104.65 v54.3,104.65 54.85,104.65 55.12,104.37 71.67,104.37 71.95,104.65 v72.61,104.65 74.83,104.65 76.42,106.25 83.68,106.25 85.5,104.42 92.67,104.42 93.03,104.77 93.58,104.77 v93.6,104.75 | v173,106 172.27,105.27 168.55,105.27 168.05,104.77 158.4,104.77 157.54,105.62 v156.54,105.62 155.21,104.3 149.33,104.3 148.85,104.77 146.43,104.77 145.75,104.1 136.82,104.1 135.87,105.05 v135.28,105.05 134.9,105.05 133.95,104.1 119.5,104.1 119.2,104.4 v118.58,104.4 117.93,104.4 117.62,104.1 97.55,104.1 96.88,104.77 93.62,104.77 v93.6,104.75 | v93.6,104.75 93.67,104.82
  Bottom 0.203: R6.8 47.2,64.35 46.13,65.42 46.13,66.88 47.33,68.08 47.33,77.97 48.02,78.66 48.85,78.66 51.35,81.16 v51.35,81.22 | v37.52,82.28 37.16,82.64 37.16,103.72 36.88,104 v36.88,104.65 36.88,105.35 37.15,105.62 37.15,106.85 36.55,107.45 Z2.2 | Z1.2 11.93,107.45 v14.4,104.98 | Z3.2 54.1,107.45 54.3,107.25 v54.3,104.65 | v118.58,104.4 118.58,105.55 116.67,107.45 Z6.2 | v156.54,105.62 154.71,107.45 Z8.2 | Z9.2 173.15,107.45 173.38,107.22 173.38,106.38 v173,106 | Z4.2 73.1,107.45 73.38,107.17 73.38,105.41 v72.61,104.65 | Z5.2 92.55,107.45 93.6,106.4 v93.6,104.75 | Z7.2 135.03,107.45 135.28,107.2 v135.28,105.05 132.19,101.97 132.19,84.92 132.5,84.61 v132.5,84.06
BLU2  (via drill 0.35)
  Top 0.203: v11.57,80.95 12.19,80.95 12.47,80.66 26.02,80.66 26.4,80.28 28.62,80.28 28.99,80.66 29.57,80.66 29.85,80.94 v30.5,80.94 31.1,80.94 31.38,80.66 41.87,80.66 42.37,80.16 46.84,80.16 47.12,79.88 v47.9,79.88 48.58,79.88 48.88,79.57 52.18,79.57 53.32,80.71 63.42,80.71 64.23,79.9 67.68,79.9 67.96,80.19 v68.6,80.19 69.17,80.19 69.55,80.56 82.59,80.56 83.25,79.9 86.7,79.9 86.98,80.19 v87.6,80.19 88.15,80.19 88.43,80.46 101.19,80.46 101.75,79.9 105.83,79.9 106.11,80.19 v106.7,80.19 107.29,80.19 107.57,80.46 119.82,80.46 120.38,79.9 127.4,79.9 127.69,80.19 v128.28,80.19 128.82,80.19 129.1,80.46 140.67,80.46 141.23,79.9 143.8,79.9 144.09,80.19 v144.82,80.19 145.45,80.19 145.73,80.46 159.79,80.46 160.35,79.9 163.03,79.9 163.31,80.19 v163.85,80.19 164.52,80.19 164.8,79.9 169.39,79.9 170.14,80.66 175.33,80.66 176.39,81.72 177.88,81.72 178.4,81.2 180.65,81.2 v183.07,83.62
  Bottom 0.203: R6.6 45.6,64.38 45.24,64.73 45.24,67.27 46.44,68.47 46.44,78.42 v47.9,79.88 49.52,81.5 49.52,83.42 49.31,83.64 Z21.2 | Z24.2 106.46,83.64 106.7,83.4 v106.7,80.19 | Z23.2 87.39,83.64 87.6,83.42 v87.6,80.19 | Z22.2 68.39,83.64 68.6,83.42 v68.6,80.19 | Z25.2 125.51,83.64 128.28,80.88 v128.28,80.19 | Z20.2 30.29,83.64 30.5,83.42 v30.5,80.94 | Z28.2 183.06,83.64 v183.07,83.62 | Z27.2 163.61,83.64 163.85,83.4 v163.85,80.19 | Z26.2 144.59,83.64 144.82,83.4 v144.82,80.19
  Bottom 0.254: Z19.2 11.29,83.64 11.57,83.35 v11.57,80.95
BLU3  (via drill 0.35)
  Top 0.203: v40.07,42.54 40.34,42.81 42.4,42.81 43.13,42.08 49.19,42.08 51.19,44.08 51.19,46.15 51.47,46.43 51.47,47.05 51.19,47.33 v51.19,47.88 | v17.18,63.15 17.47,63.44 24.15,63.44 25.2,64.5 32.28,64.5 35.43,61.34 37.8,61.34 39.53,63.07 v40.15,63.07 40.72,63.07 41,62.79 42.04,62.79 42.81,63.56 48.34,63.56 50.01,61.89 51.2,61.89 v51.92,61.17 52.48,61.17 52.76,60.89 58.12,60.89 58.4,61.17 v59,61.17 59.57,61.17 59.85,60.89 77.28,60.89 77.55,61.17 v78.2,61.17 78.82,61.17 79.1,60.89 96.22,60.89 96.5,61.17 v97.15,61.17 97.75,61.17 98.03,60.89 115.33,60.89 115.6,61.17 v116.22,61.17 116.87,61.17 117.15,60.89 134.4,60.89 134.68,61.17 v135.32,61.17 135.95,61.17 136.22,60.89 153.38,60.89 153.65,61.17 v154.38,61.17 155.02,61.17 155.3,60.89 170.54,60.89 173.65,64 v173.65,64.6
  Bottom 0.203: R7.6 27.4,41.75 27.6,41.55 28.98,41.55 30.72,43.3 34.03,43.3 35.08,42.25 39.78,42.25 v40.07,42.54 | v51.19,47.88 51.19,48.4 50.91,48.68 50.91,60.16 v51.92,61.17 | Z38.2 39.81,64.59 40.15,64.25 v40.15,63.07 | Z37.2 16.29,64.59 17.18,63.7 v17.18,63.15 | Z39.2 58.81,64.59 59,64.4 v59,61.17 | Z40.2 77.94,64.59 78.2,64.33 v78.2,61.17 | Z41.2 96.94,64.59 97.15,64.38 v97.15,61.17 | Z45.2 173.64,64.59 v173.65,64.6 | Z42.2 115.99,64.59 116.5,64.08 116.5,62.02 116.22,61.74 v116.22,61.17 | Z43.2 135.06,64.59 135.32,64.33 v135.32,61.17 | Z44.2 154.14,64.59 154.38,64.35 v154.38,61.17
BLU4  (via drill 0.35)
  Top 0.203: v25.78,41.38 24.86,41.38 24.58,41.66 18.94,41.66 18.68,41.92 v17.9,41.92 | v43,40.45 43.6,40.45 43.89,40.75 49.77,40.75 51.94,42.92 56.61,42.92 57.07,43.37 57.82,43.37 59.12,42.07 v61.35,42.07 62.05,42.07 62.36,42.38 75,42.38 76.03,41.35 78.43,41.35 79.05,41.97 81.8,41.97 82.08,42.25 v82.67,42.25 83.25,42.25 83.53,41.97 99.85,41.97 100.12,41.69 v101.97,41.69 102.65,41.69 102.92,41.97 119,41.97 119.28,41.69 v119.92,41.69 120.53,41.69 121.31,42.47 139.1,42.47 139.38,42.75 v140.12,42.75 140.8,42.75 141.07,42.47 147.81,42.47 | 147.81,42.47 | 147.81,42.47 148.19,42.47 158.18,42.47 158.45,42.75 v159.1,42.75 159.72,42.75 160,42.47 175.34,42.47 v178.4,45.52
  Bottom 0.203: Z55.2 18.34,45.54 18.62,45.26 18.62,44.68 17.9,43.96 v17.9,41.92 | R7.8 25.8,41.4 v25.78,41.38 25.78,40.64 26.36,40.06 28.29,40.06 28.69,39.66 29.29,39.66 29.73,40.1 29.73,40.42 31.27,41.96 33.47,41.96 34.52,40.91 41.37,40.91 41.84,40.45 v43,40.45 43.71,41.16 Z56.2 | v61.35,42.07 63.75,44.47 63.75,45.38 63.59,45.54 Z57.2 | Z58.2 82.61,45.54 82.83,45.33 82.83,42.9 82.67,42.75 v82.67,42.25 | v101.97,41.69 102,41.72 102,45.3 101.76,45.54 Z59.2 | Z60.2 120.74,45.54 121,45.27 121,42.77 v119.92,41.69 | Z61.2 139.84,45.54 140.12,45.25 v140.12,42.75 | Z62.2 158.84,45.54 159.1,45.27 v159.1,42.75 | Z63.2 178.39,45.54 v178.4,45.52
BLU5  (via drill 0.35)
  Top 0.203: v10.95,31.92 11.3,31.58 11.3,30.43 14.1,27.62 16.2,27.62 16.57,27.25 16.57,24.48 17.7,23.35 21.55,23.35 22.63,24.43 22.94,24.43 24.07,25.56 v24.07,26.79 | v31.43,31.81 32.28,30.96 35.43,30.96 41.53,24.86 45.9,24.86 46.49,25.45 48.6,25.45 49.8,24.26 53.37,24.26 53.65,24.54 v54.3,24.54 54.9,24.54 55.18,24.26 64.03,24.26 65.19,25.41 67.49,25.41 68.05,24.86 68.73,24.86 69.2,24.39 73.21,24.39 73.92,25.11 v73.92,25.14 74.3,25.51 74.69,25.51 77.26,28.09 82.74,28.09 84.41,26.41 85.31,26.41 86.52,25.21 86.72,25.21 87,24.93 87.58,24.93 88.13,24.38 92.17,24.38 v93,25.21 93.14,25.21 93.24,25.31 95.92,25.31 96.3,24.93 102.65,24.93 103.2,25.48 106.12,25.48 107.23,24.38 110.92,24.38 111.23,24.68 v111.83,24.68 112.45,24.68 112.73,24.41 119.56,24.41 120.04,24.89 122.39,24.89 122.68,24.59 123.94,24.59 124.64,23.89 129.97,23.89 130.25,24.16 v130.85,24.16 131.45,24.16 131.73,23.89 141.71,23.89 142.26,24.44 145.13,24.44 145.63,23.93 148.72,23.93 148.98,24.19 v149.57,24.19 150.17,24.19 150.45,23.91 156.35,23.91 156.82,23.43 160.15,23.43 160.43,23.71 v160.97,23.71
  Bottom 0.203: 22.3,42.27 R8.8 22.3,41.85 22.07,41.62 21.65,41.62 18.64,38.62 12.9,38.62 10.51,36.23 10.51,32.36 v10.95,31.92 | Z71.2 23.26,26.49 23.56,26.79 v24.07,26.79 24.59,26.79 29.61,31.81 v31.43,31.81 | v54.3,24.54 54.3,26.18 53.99,26.49 Z72.2 | v73.92,25.14 73.92,26.05 73.49,26.49 Z73.2 | v93,25.21 93,26 92.51,26.49 Z74.2 | v111.83,24.68 111.83,26.23 111.56,26.49 Z75.2 | v130.85,24.16 130.85,26.2 130.56,26.49 Z76.2 | v149.57,24.19 149.57,26.23 149.31,26.49 Z77.2 | v160.97,23.71 166.81,23.71 168.55,25.45 168.55,26.27 168.34,26.49 Z78.2
BLU6  (via drill 0.35)
  Top 0.203: v152.18,7.45 153.45,8.72 153.45,9.5 v154.4,10.45 | v146.22,11.91 146.22,12.51 145.39,13.34 145.39,19.46 142.97,21.88 119.97,21.88 119.7,21.6 v118.97,21.6 118.3,21.6 118,21.9 105.92,21.9 105.37,22.45 96.28,22.45 96,22.18 v95.42,22.18 94.85,22.18 94.58,21.9 87.11,21.9 86.55,22.45 84.73,22.45 81.57,25.61 78.36,25.61 74.54,21.78 68.12,21.78 67.85,22.06 v67.22,22.06 66.68,22.06 66.4,21.78 47.71,21.78 47.16,22.34 45.85,22.34 45.55,22.04 v44.95,22.04 44.33,22.04 44.02,22.34 40.55,22.34 34.41,28.48 30,28.48 29.69,28.18 v28.98,28.18 | v22.47,11.59 18.31,7.44 v14.01,7.44
  Bottom 0.203: Z107.2 171.14,7.44 171.92,8.22 171.92,9.32 170.74,10.51 165.75,10.51 164.73,9.48 154.8,9.48 154.4,9.88 v154.4,10.45 153.83,10.45 152.88,11.39 146.74,11.39 v146.22,11.91 145.52,12.61 144.89,12.61 143.26,10.98 139.11,10.98 136.14,8.01 133.29,8.01 132.71,7.44 Z91.2 | Z106.2 152.16,7.44 v152.18,7.45 | R8.6 23.9,40.75 25.48,39.17 27.9,39.17 28.55,38.52 28.55,35.71 32.16,32.11 32.16,30.96 29.8,28.6 29.4,28.6 v28.98,28.18 28.48,27.68 28.48,27.27 25.43,24.22 25.43,14.56 v22.47,11.59 | Z88.2 v14.01,7.44 14.03,7.45 | v118.97,21.6 118.08,20.71 118.08,20 117.6,19.52 116.62,19.52 115.67,18.58 115.67,17.13 115.22,16.68 115.22,10.77 Z105.2 | v95.42,22.18 95.42,21.55 95.14,21.27 95.14,17.25 95.4,17 95.4,15.53 96.1,14.83 96.1,9.85 94.78,8.52 94.78,7.66 94.55,7.44 Z104.2 | Z90.2 61.19,7.44 61.7,7.95 63.58,7.95 67,11.37 67,20.62 67.22,20.85 v67.22,22.06 | Z89.2 37.56,7.44 38.12,8 41.63,8 44.98,11.35 44.98,22.01 v44.95,22.04
BLU7  (9 unrouted)
BLU8  (10 unrouted)
BLU9  (via drill 0.35)  (10 unrouted)
  Bottom 0.203: Z49.2 249.29,64.59 249.68,64.97 249.68,66.75 249.5,66.92 v249.5,67.5
BLU10  (7 unrouted)
BLU11  (9 unrouted)
BLU12  (8 unrouted)
BOOT0  (via drill 0.35)
  Top 0.254: v293.4,65.9 293.4,66.4 290.8,69 281.16,69 v280.63,69.53 | v261.95,62.35 261.6,62 260.9,62 v260.5,61.6 259.6,62.51 249.5,62.51 249.49,62.49 248.77,62.49 248.19,61.92 245.1,61.92 244.52,62.51 230.5,62.51 230.49,62.49 229.77,62.49 229.22,61.95 225.95,61.95 225.4,62.51 213,62.51 | v199.75,41.51 122.23,41.51 121,40.27 v121,40.25 | v114.5,17.62 113.83,17.62 113.58,17.87 82.57,17.87 81.95,17.25 78.9,17.25 v78.5,16.85 | 213,62.51 213,62.49 | 213,62.51 211.88,62.51 211.6,62.23 v211.06,62.23
  Bottom 0.254: U1.44 293.4,65.34 v293.4,65.9 | v261.95,62.35 262.08,62.48 265.78,62.48 268.64,59.62 270.72,59.62 272.71,61.61 275.99,61.61 277.78,63.4 277.78,66.68 v280.63,69.53 | v121,40.25 121,39.75 117.5,36.25 117.5,21.7 114.5,18.7 v114.5,17.62 | v199.75,41.51 203.05,44.8 203.05,55 210.28,62.23 v211.06,62.23 | C29.1 70.5,20.45 R21.2 R22.2 R20.1 76.45,19.85 78.5,17.8 v78.5,16.85
BOOT1
  Bottom 0.254: 285.03,59.03 U1.20 282.9,56.96 282.9,55.58 282.07,54.75 282.07,54.25 280.85,53.02 R66.2
COL0  (via drill 0.35)
  Top 0.254: v86.6,102.45 84.5,102.45 83.7,103.25 24.07,103.25 23.09,104.23 12.18,104.23 10.72,102.78 8.53,102.78 7.81,103.5 v7.81,104.1 | v9.82,28 8.91,28 8.73,27.83 v7.96,27.83
  Bottom 0.254: R4.7 v86.6,102.45 86.42,102.28 U2.1 | D88.C 3.26,7.78 2.32,8.72 2.32,13.88 2.02,14.17 2.02,17.4 2.32,17.69 2.32,24.5 5.04,27.22 7.35,27.22 v7.96,27.83 4.67,31.12 4.67,44.19 v6.35,45.88 | v6.35,45.88 5.33,46.9 5.33,59 4,60.33 4,63.73 v5.2,64.92 v5.2,64.93 | D1.C 2.03,106.92 4.61,104.35 6.76,104.35 7.01,104.1 v7.81,104.1 8.66,104.1 8.91,104.35 11.22,104.35 16.75,98.83 16.75,85.03 11.72,80 4.83,80 4.65,80.17 v4.05,80.17 | D71.C 12.36,26.83 11.19,28 v9.82,28 | D37.C v5.2,64.93 | v5.2,64.93 5.15,64.93 4.03,66.05 4.03,80.15 v4.05,80.17 | D19.C 2.03,82.19 v4.05,80.17 | D55.C v6.35,45.88
COL1  (via drill 0.35)
  Top 0.254: v87.41,101.84 v87.4,101.84 87.26,101.7 84.52,101.7 83.46,102.76 26.26,102.76 v25.85,102.35 | v48.9,61.35 47.61,62.64 43.19,62.64 42.4,61.85 39.64,61.85 38.21,60.43 35.05,60.43 32.46,63.02 31.4,63.02 31.15,63.28 v30.6,63.28 | v26.73,12.78 26.73,17.82 28,19.1 v28,24 | v34.6,44.45 34.6,43.62 38,40.22 38,39.14 v38.45,38.7
  Bottom 0.254: R4.6 v87.4,101.85 | v87.4,101.85 v87.41,101.84 | U2.2 87.17,101.62 v87.4,101.85 | D2.C v25.84,102.36 v25.85,102.35 23.93,100.43 23.18,100.43 18.65,95.9 18.65,85.18 19.86,83.98 D20.C 21.08,83.1 23.48,80.71 23.48,80.24 28.07,75.64 28.07,71.58 29.4,70.25 29.4,65.23 29.71,64.93 D38.C v30.61,63.28 v30.6,63.28 | D89.C 28.32,7.65 26.73,9.25 v26.73,12.78 | v48.9,61.35 48.91,61.35 49.48,60.78 49.48,40.78 47.3,38.59 42.09,38.59 40.73,39.95 39.7,39.95 v38.45,38.7 v38.46,38.7 39.28,37.88 39.28,33 36.42,30.14 36.42,28.95 34.83,27.35 31.17,27.35 29,25.18 29,25 v28,24 | D56.C 35.37,45.22 v34.6,44.45
  Bottom 0.305: D38.C 30.61,64.87
COL2  (via drill 0.35)  (1 unrouted)
  Top 0.254: v88.21,101.24 88.21,101.22 88.09,101.1 84.42,101.1 83.26,102.26 45.26,102.26 v44.89,101.89 | v43.19,67.15 46.29,67.15 v46.85,66.58 | v44.88,25.62 44.88,30.92 44.29,31.5 44.29,32.84 42.15,34.98 v42.15,35.98
  Bottom 0.254: R4.5 v88.2,101.25 v88.21,101.24 87.95,100.97 U2.3 | D3.C v44.89,101.89 37.62,94.62 37.62,85.21 38.86,83.98 D21.C 40.13,80.78 42.74,78.17 43.89,78.17 44.64,77.42 44.64,69.22 43.19,67.77 v43.19,67.15 | D90.C 50.76,7.78 48.88,9.66 48.88,21.37 | v46.85,66.58 48.23,65.21 48.51,64.93 D39.C 49.66,61.34 50,61 50,46.42 50.54,45.88 D57.C 54.42,45 47.52,38.1 43.5,38.1 42.15,36.75 v42.15,35.98 | D72.C 44.89,25.64 v44.88,25.62
COL3  (via drill 0.35)
  Top 0.254: v89.8,102.4 89.8,101.77 88.52,100.49 84.3,100.49 83.03,101.77 62.77,101.77 v62.42,101.42
  Bottom 0.254: R5.8 v89.8,102.4 89.8,101.02 89.1,100.33 U2.4 | D73.C 61.79,26.83 61.05,27.57 61.05,37.05 65,41 69.44,41 73.47,45.03 D58.C 72.22,45.88 70,48.09 70,60 68.71,61.29 D40.C 67.51,64.93 65,67.43 65,76.95 63.33,78.62 60.9,78.62 59.18,80.33 D22.C 57.96,83.98 56,85.93 56,95 v62.42,101.42 63.94,102.94 D4.C
COL4  (via drill 0.35)
  Top 0.254: v79.45,40 v79.44,39.99 75.47,39.99 74.43,41.03 64.33,41.03 63.33,40.03 63.03,40.03 63,39.99 60.49,39.99 60.21,40.27 58.37,40.27 58.1,40.54 56.69,40.54 56.56,40.67 52.87,40.67 50.7,38.5 45.85,38.5 45.28,37.93 38.09,37.93 37.41,38.61 37.41,39.99 33.17,44.23 v33.17,44.77 | v90.61,101.8 90.61,102.72 90.05,103.28 84.6,103.28 v83,104.88
  Bottom 0.254: R5.7 v90.6,101.8 v90.61,101.8 90.61,101.13 89.15,99.67 U2.5 | D74.C 81.89,26.83 79.45,29.27 v79.45,40 87.39,40 92.52,45.13 D59.C 91.29,45.88 89,48.17 89,58.75 88,59.75 88,64.68 D41.C 86.48,64.93 84,67.41 84,77.97 83.35,78.63 79.5,78.63 78.23,79.9 D23.C 76.93,83.98 74.6,86.31 74.6,96.2 72,98.8 72,102.35 75.05,105.39 81.81,105.39 82.32,104.88 v83,104.88 D5.C | D101.C v33.17,44.78 v33.17,44.77
COL5  (via drill 0.35)
  Top 0.254: v120.97,19.12 120.38,19.12 120.12,18.88 115.08,18.88 113.95,20 108.03,20 107.7,19.68 v107.08,19.68 | v91.41,101.19 92,101.78 92.57,101.78 v93.72,102.92
  Bottom 0.254: R5.6 v91.4,101.2 v91.41,101.19 | v91.41,101.19 | U2.6 89.24,99.03 v91.41,101.19 | v107.08,19.68 107.08,21.8 106.16,22.71 104.24,22.71 102.04,24.91 D75.C 100.87,26.83 98.6,29.1 98.6,37.85 100.75,40 108,40 111.57,43.57 D60.C 110.32,45.88 107.85,48.34 107.85,60.15 106.81,61.19 D42.C 105.58,64.93 103.25,67.26 103.25,75.92 100.83,78.35 99.1,78.35 97.28,80.17 D24.C 96.11,83.98 93.72,86.36 v93.72,102.92 96.79,106 105.74,106 106.81,107.06 D6.C | D91.C 122.28,7.78 120.97,9.08 v120.97,19.12
COL6  (via drill 0.35)
  Top 0.254: v92.95,96.53 103.53,96.53 104.73,97.73 106.66,97.73 106.94,98.01 114.5,98.01 114.7,97.81 114.7,97.8 114.74,97.76 v115.72,97.76 115.72,93.83 115.73,93.82 115.73,88.73 116,88.45 116,86.42 115,85.42 v115,84 | v22.85,23.62 23.61,24.39 24.02,24.39 27.36,27.73 27.36,28.64 28.32,29.6 34.87,29.6 40.97,23.5 47.77,23.5 48.38,22.9 65.42,22.9 66.03,23.5 68.03,23.5 68.62,22.9 74,22.9 77.83,26.73 82.17,26.73 85.33,23.57 87.02,23.57 87.57,23.02 93.45,23.02 94.38,23.95 95.36,23.95 95.74,23.57 106.04,23.57 106.59,23.02 120.12,23.02 120.38,23.27 v121.1,23.27 | v130.62,44.67 129.98,45.32 129.98,50.88 129.95,50.91 129.95,53.55 v128,55.5
  Bottom 0.254: U2.7 89,98.38 | 89,98.38 89.38,98.38 91.42,100.42 92.2,100.42 | D7.C 125.86,101.78 122.29,98.21 116.18,98.21 v115.72,97.76 | v121.1,23.27 v121.09,23.28 D76.C 119.89,26.83 118,28.72 118,36.05 121.96,40.01 127.01,40.01 130.62,43.62 v130.62,44.67 v130.62,44.68 D61.C | v22.85,23.62 22.85,22.87 19.67,19.69 19.67,12.32 18.9,11.55 18.9,8.07 19.32,7.65 D102.C | v92.95,96.53 92.2,97.28 92.2,100.42 | 92.2,100.42 R5.5 | 89,98.38 | v115,84 115.02,83.98 D25.C 116.33,79.59 118.17,77.75 120.2,77.75 121.92,76.03 121.92,67.61 124.61,64.93 D43.C 125.86,63 128,60.86 v128,55.5
COL7  (via drill 0.35)
  Top 0.254: v228.6,102.4 204.56,102.4 201.69,105.26 198.23,105.26 195.92,102.95 183.67,102.95 182.97,103.65 170.7,103.65 170.2,104.15 169.06,104.15 168.56,103.65 158.73,103.65 158.19,103.11 148.27,103.11 148.02,103.36 v147.34,103.36
  Bottom 0.254: R2.7 v228.6,102.4 228.47,102.28 U3.1 | D77.C 138.89,26.83 136.6,29.12 136.6,35.45 139.72,38.58 145.5,38.58 149.67,42.74 D62.C 148.42,45.88 146,48.3 146,59.9 145,60.9 145,64.83 D44.C 143.66,64.93 140.78,67.81 140.78,76.01 135.38,81.4 D26.C 134.01,83.98 132.97,85.01 132.97,94.7 v144.9,106.62 v144.91,106.63 | 144.83,107.79 D8.C v144.91,106.63 | v147.34,103.36 145.68,105.03 145.68,105.86 v144.91,106.63
COL8  (via drill 0.35)
  Top 0.254: v229.41,101.8 229.05,101.8 228.91,101.65 228.29,101.65 228.04,101.91 204.34,101.91 201.49,104.76 198.45,104.76 196.15,102.46 183.44,102.46 182.74,103.16 170.47,103.16 170.24,103.39 v169.64,103.39 | v161.8,66.42 159.66,68.57 v159.66,68.58 | v167.4,81.38 156.8,81.38 156.5,81.68 v155.9,81.68